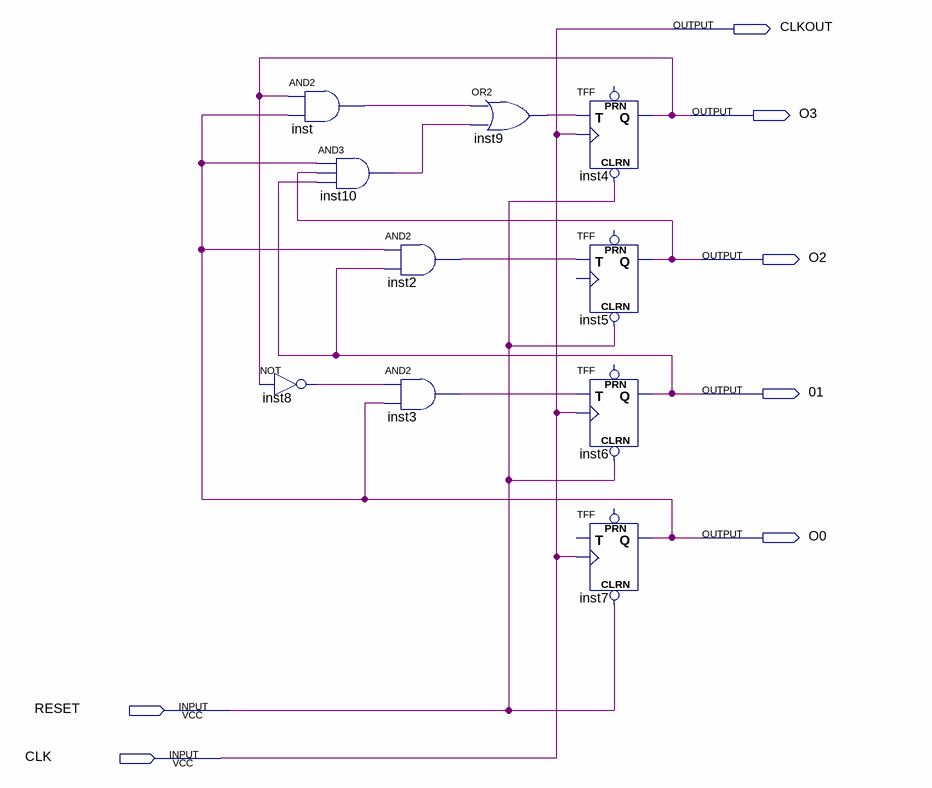
[diagram p0: schematic sheet]
// Quartus schematic 4bit bcd counter.bdf as structural Verilog: 10 symbols, 7 pins
module \4bit_bcd_counter  (
  input  RESET,
  input  CLK,
  output CLKOUT,
  output O3,
  output O2,
  output \01 ,
  output O0
);

  wire inst2_out, inst3_out, inst8_out, inst9_out, inst10_out, inst_out;

  not inst8 (inst8_out, O3);
  and inst (inst_out, O3, O0);
  and inst10 (inst10_out, O0, O2, \01 );
  and inst2 (inst2_out, O0, \01 );
  and inst3 (inst3_out, inst8_out, O0);
  or inst9 (inst9_out, inst_out, inst10_out);
  TFF inst4 (.CLRN(RESET), .T(inst9_out), .CLK(CLK), .Q(O3));  // open: PRN
  TFF inst5 (.CLRN(RESET), .T(inst2_out), .Q(O2));  // open: PRN, CLK
  TFF inst6 (.CLRN(RESET), .T(inst3_out), .CLK(CLK), .Q(\01 ));  // open: PRN
  TFF inst7 (.CLRN(RESET), .CLK(CLK), .Q(O0));  // open: PRN, T

  assign CLKOUT = CLK;
endmodule
